# Altium schematic sheet thruster_ctrl_and_pressure_sensor.SchDoc
size A4
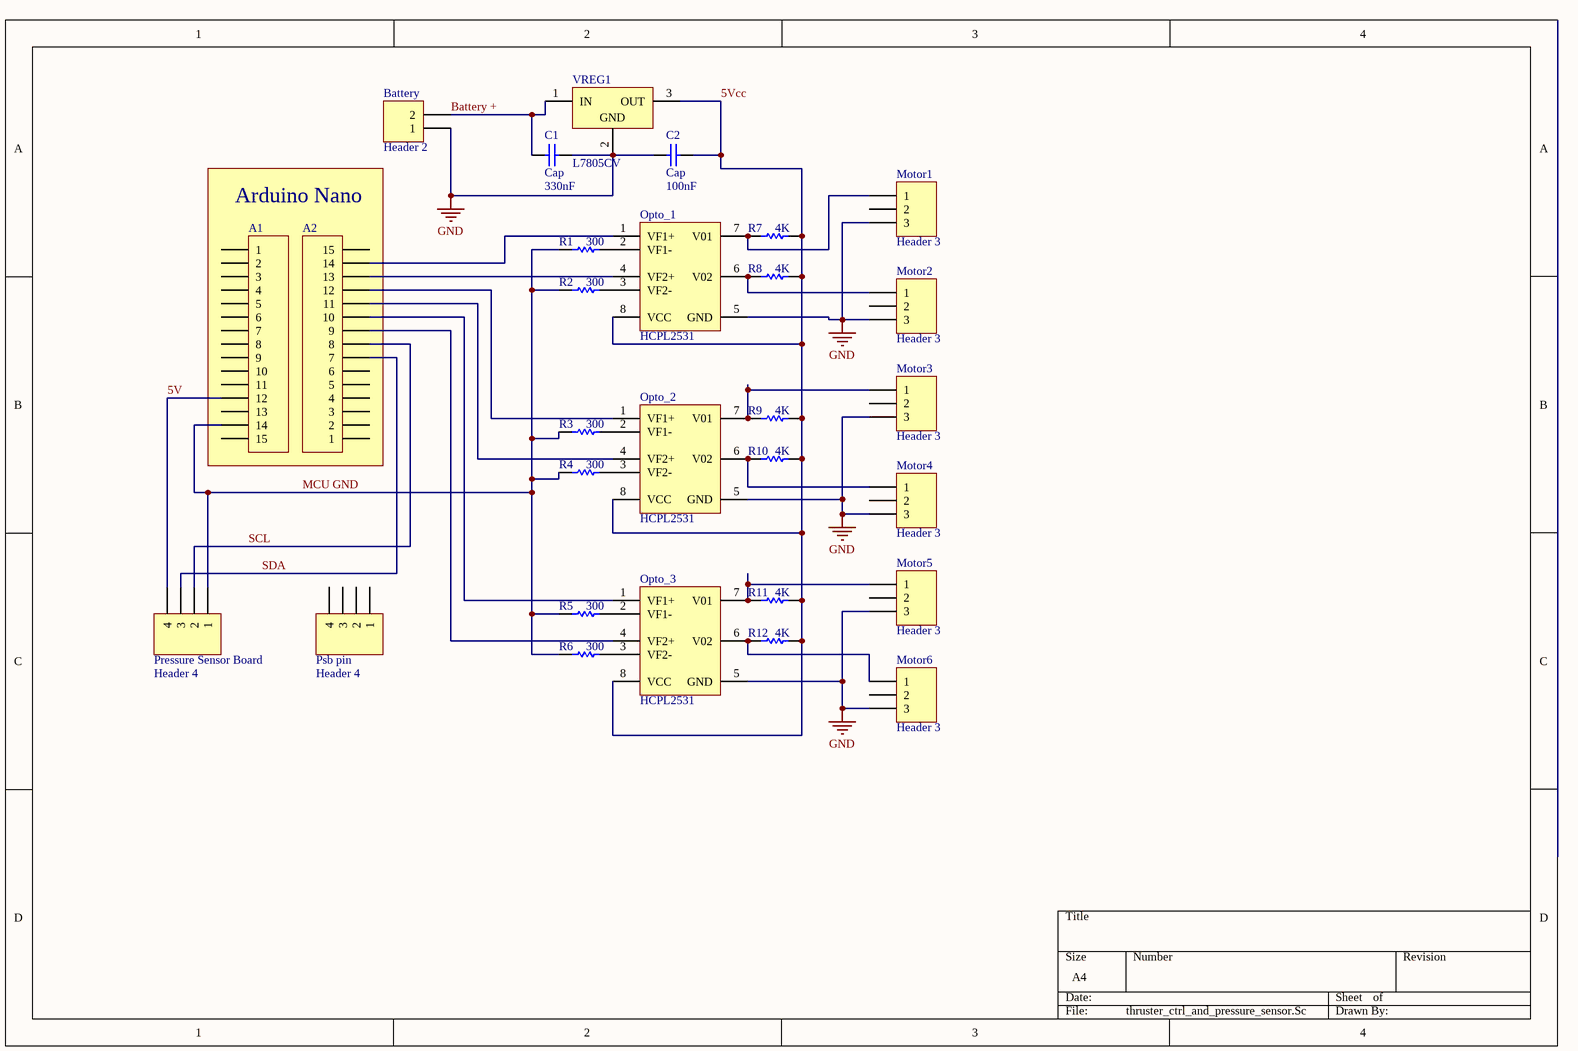
[diagram p0: thruster_ctrl_and_pressure_sensor.SchDoc]

## Parts
A1  Header 15  [HDR1X15]  (value not drawn)
A2  Header 15  [HDR1X15]  (value not drawn)
Battery  Header 2  [HDR1X2]
C1  Cap  value 330nF  [HDR1X2]
C2  Cap  value 100nF  [HDR1X2]
Motor1  Header 3  [HDR1X3]
Motor2  Header 3  [HDR1X3]
Motor3  Header 3  [HDR1X3]
Motor4  Header 3  [HDR1X3]
Motor5  Header 3  [HDR1X3]
Motor6  Header 3  [HDR1X3]
Opto_1  HCPL2531  [FAIR-MDIP-8]
Opto_2  HCPL2531  [FAIR-MDIP-8]
Opto_3  HCPL2531  [FAIR-MDIP-8]
Pressure_Sensor_Board  Header 4  [HDR1X4]
Psb_pin  Header 4  [HDR1X4]
R1  300  [AXIAL-0.3]
R2  300  [AXIAL-0.3]
R3  300  [AXIAL-0.3]
R4  300  [AXIAL-0.3]
R5  300  [AXIAL-0.3]
R6  300  [AXIAL-0.3]
R7  value 4K  [AXIAL-0.3]  (hidden comment: 300)
R8  value 4K  [AXIAL-0.3]  (hidden comment: 300)
R9  value 4K  [AXIAL-0.3]  (hidden comment: 300)
R10  value 4K  [AXIAL-0.3]  (hidden comment: 300)
R11  value 4K  [AXIAL-0.3]  (hidden comment: 300)
R12  value 4K  [AXIAL-0.3]  (hidden comment: 300)
VREG1  L7805CV  [TO220]

## Blocks framed on the sheet
Arduino Nano: A1 A2

## Nets
GND: Battery.1 C1.2 C2.1 Motor1.3 Motor2.3 Motor3.3 Motor4.3 Motor5.3 Motor6.3 Opto_1.5(GND) Opto_2.5(GND) Opto_3.5(GND) VREG1.2(GND)
5V: A1.12 Pressure_Sensor_Board.4
5Vcc: C2.2 Opto_1.8(VCC) Opto_2.8(VCC) Opto_3.8(VCC) R7.2 R8.2 R9.2 R10.2 R11.2 R12.2 VREG1.3(OUT)
Battery +: Battery.2 C1.1 VREG1.1(IN)
MCU GND: A1.14 Pressure_Sensor_Board.1 R1.1 R2.1 R3.1 R4.1 R5.1 R6.1
SCL: A2.8 Pressure_Sensor_Board.2
SDA: A2.7 Pressure_Sensor_Board.3
NetA2_9: A2.9 Opto_3.4(VF2+)
NetA2_10: A2.10 Opto_3.1(VF1+)
NetA2_11: A2.11 Opto_2.4(VF2+)
NetA2_12: A2.12 Opto_2.1(VF1+)
NetA2_13: A2.13 Opto_1.4(VF2+)
NetA2_14: A2.14 Opto_1.1(VF1+)
NetMotor1_1: Motor1.1 Opto_1.7(V01) R7.1
NetMotor2_1: Motor2.1 Opto_1.6(V02) R8.1
NetMotor3_1: Motor3.1 Opto_2.7(V01) R9.1
NetMotor4_1: Motor4.1 Opto_2.6(V02) R10.1
NetMotor5_1: Motor5.1 Opto_3.7(V01) R11.1
NetMotor6_1: Motor6.1 Opto_3.6(V02) R12.1
NetOpto_1_2: Opto_1.2(VF1-) R1.2
NetOpto_1_3: Opto_1.3(VF2-) R2.2
NetOpto_2_2: Opto_2.2(VF1-) R3.2
NetOpto_2_3: Opto_2.3(VF2-) R4.2
NetOpto_3_2: Opto_3.2(VF1-) R5.2
NetOpto_3_3: Opto_3.3(VF2-) R6.2

Not connected (* = marked no-connect by the designer): A1 1 2 3 4 5 6 7 8 9 10 11 13 15; A2 1 2 3 4 5 6 15; Motor1 2; Motor2 2; Motor3 2; Motor4 2; Motor5 2; Motor6 2; Psb_pin 1 2 3 4

## Library data of the parts
A1 A2 = Header 15: Header, 15-Pin; LatestRevisionDate: 17-Jul-2002; LatestRevisionNote: Re-released for DXP Platform.; Publisher: Altium Limited
Battery = Header 2: Header, 2-Pin; LatestRevisionDate: 17-Jul-2002; LatestRevisionNote: Re-released for DXP Platform.; Publisher: Altium Limited
C1 C2 = Cap: Capacitor; Published: 8-Jun-2000; LatestRevisionDate: 17-Jul-2002; LatestRevisionNote: Re-released for DXP Platform.; PackageReference: RAD-0.3; Publisher: Altium Limited; PackageDescription: Radial Cap, Thru-Hole; 2 Leads; 0.3 in Pin Spacing
Motor1-Motor6 = Header 3: Header, 3-Pin; LatestRevisionDate: 17-Jul-2002; LatestRevisionNote: Re-released for DXP Platform.; Publisher: Altium Limited
Opto_1-Opto_3 = CMP-2000-06391-1: Dual-Channel High Speed Transistor Output Optocoupler, 1.45 V Forward Voltage, -55 to 100 degC, 8-Pin DIP, RoHS, Tube; Manufacturer: FairchildSemiconductor; Maximum Current Transfer Ratio @ Current: 50%; Maximum Forward Voltage: 1.7V; Output Type: DC; Typical Forward Voltage: 1.45V; Maximum Reverse Voltage: 5V; Maximum Collector Current: 8mA; Maximum Power Dissipation: 100mW; Maximum Input Current: 25mA; Number of Channels per Chip: 2; Minimum Isolation Voltage: 2500Vrms; Manufacturer URL: https://www.fairchildsemi.com/; Package URL: https://www.fairchildsemi.com/package-drawings/N0/N08G.pdf; Mounting Technology: ThroughHole; Package: 8PDIPBlack; Package Reference: MDIP-8; Category: TransistorandPhotovoltaicOutputPhotoCouplers; Datasheet Version: Rev. 1.0.7, 08/2008; Datasheet URL: https://www.fairchildsemi.com/datasheets/HC/HCPL2531.pdf; Input Type: DC; Packaging: Rail/Tube; Operating Temperature: -55to100°C; Package Description: 8-Pin Double In-Line Package, Body 9.655 x 6.605 mm, Pitch 2.54 mm
Pressure_Sensor_Board Psb_pin = Header 4: Header, 4-Pin; LatestRevisionDate: 17-Jul-2002; LatestRevisionNote: Re-released for DXP Platform.; Publisher: Altium Limited
R1-R12 = Res1: Resistor; Published: 8-Jun-2000; LatestRevisionDate: 17-Jul-2002; LatestRevisionNote: Re-released for DXP Platform.; PackageReference: AXIAL-0.3; Publisher: Altium Limited; PackageDescription: Axial Device, Thru-Hole; 2 Leads; 0.3 in Pin Spacing
  R1-R6: Value: 300
VREG1 = CMP-0244-00483-1: Positive Voltage Regulator, 5V, 3-Pin TO-220; PackageDescription: TO, Thru-Hole, Vertical, Heatsink Mounted; 3 In-Line Leads; Pitch 2.54 mm; ComponentLink2Description: Datasheet; PackageReference: TO220; ComponentLink3URL: http://www.st.com/internet/com/TECHNICAL_RESOURCES/TECHNICAL_LITERATURE/PACKAGE_INFORMATION/CD00004649.pdf; DatasheetVersion: 16/11/2011; ComponentLink1Description: Manufacturer URL; ComponentLink1URL: http://www.st.com; PackageVersion: ver3.0; ComponentLink3Description: Package Specification; ComponentLink2URL: http://www.st.com/internet/com/TECHNICAL_RESOURCES/TECHNICAL_LITERATURE/DATASHEET/CD00000444.pdf